# Altium project dory-x.PrjPcb (part 7 of 12)
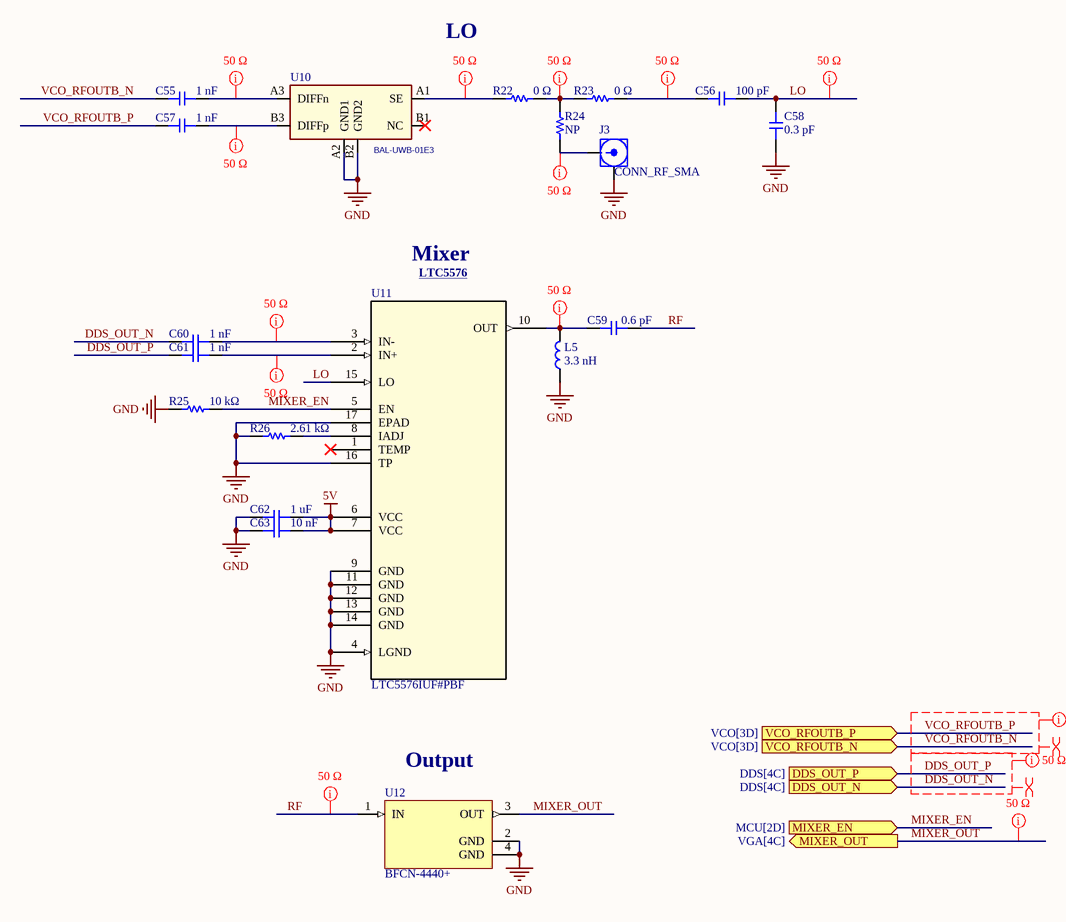
[diagram p13: MIXER.SchDoc]

## Sheet MIXER.SchDoc (continued)

### Library data of the parts (continued)
L5 = IND: Ind RF Chip Unshielded Wirewound 3.3nH 0.1nH 100MHz 30Q-Factor Ferrite 2A 0402 Paper T/R; Manufacturer: Murata Electronics; Manufacturer Part Number: LQW15AN3N3B80D; Manufacturer Lifecycle Status: IN PRODUCTION; Tolerance: +-0.1 nH; Core Material: Non-Magnetic; DC Resistance (DCR): 30mΩ; Number of Circuits: 1; Q Factor: 30; Self Resonant Frequency: 14GHz; Test Frequency: 250MHz; Current Rating: 2 A; Package Size: 0402; Supplier: DigiKey; Supplier Part Number: 490-7641-1-ND; RoHS: Compliant; Category: Fixed Inductors; Stock: 262412; Pricing: 1=0.16, 10=0.134, 100=0.1105, 1000=0.09089, 5000=0.07928 (USD); Case/Package: 0402; Case Code (Imperial): 0402; Case Code (Metric): 1005; Composition: Wirewound; Country of Origin: Japan, Malaysia; Export Control Classification Number (ECCN) Code: EAR99; Height: 500µm; Height - Seated (Max): 609.6µm; Harmonized Tariff Schedule (HTS) Code: 8504.50.80.00; Value: 3.3nH; Introduction Date: 2013-06-20; Length: 1mm; Lifecycle Status: Production; Max Current Rating: 2A; Max DC Current: 2A; Max Operating Temperature: 125°C; Min Operating Temperature: -55°C; Mounting Technology: Surface Mount; Number of Terminals: 2; Packaging: Cut Tape; REACH SVHC: Yes; RMS Current (Irms): 2A; Schedule B: 8504500000, 8504500000|8504500000|8504500000|8504500000|8504500000; ESR: 30mΩ; Shielding: Unshielded; Termination: SMD/SMT; Width: 600µm; ComponentLink1URL: https://datasheet.octopart.com:443/LQW15AN3N3B80D-Murata-datasheet-104420733.pdf?src-supplier=Farnell; ComponentLink1Description: https://datasheet.octopart.com:443/LQW15AN3N3B80D-Murata-datasheet-104420733.pdf?src-supplier=Farnell; ComponentLink2URL: https://datasheet.octopart.com:443/LQW15AN3N3B80D-Murata-datasheet-142541413.pdf?src-supplier=Ciiva; ComponentLink2Description: https://datasheet.octopart.com:443/LQW15AN3N3B80D-Murata-datasheet-142541413.pdf?src-supplier=Ciiva; ComponentLink3URL: https://datasheet.octopart.com:443/LQW15AN3N3B80D-Murata-datasheet-141294499.pdf?src-supplier=Ciiva; ComponentLink3Description: https://datasheet.octopart.com:443/LQW15AN3N3B80D-Murata-datasheet-141294499.pdf?src-supplier=Ciiva; ComponentLink4URL: https://datasheet.octopart.com:443/LQW15AN3N3B80D-Murata-datasheet-140716658.pdf?src-supplier=Ciiva; ComponentLink4Description: https://datasheet.octopart.com:443/LQW15AN3N3B80D-Murata-datasheet-140716658.pdf?src-supplier=Ciiva; ComponentLink5URL: https://datasheet.octopart.com:443/LQW15AN3N3B80D-Murata-datasheet-138757718.pdf?src-supplier=Ciiva; ComponentLink5Description: https://datasheet.octopart.com:443/LQW15AN3N3B80D-Murata-datasheet-138757718.pdf?src-supplier=Ciiva; ComponentLink6URL: https://datasheet.octopart.com:443/LQW15AN3N3B80D-Murata-datasheet-145451984.pdf?src-supplier=Geoflip; ComponentLink6Description: https://datasheet.octopart.com:443/LQW15AN3N3B80D-Murata-datasheet-145451984.pdf?src-supplier=Geoflip; ComponentLink7URL: https://datasheet.octopart.com:443/LQW15AN3N3B80D-Murata-datasheet-142296072.pdf?src-supplier=Arrow.cn; ComponentLink7Description: https://datasheet.octopart.com:443/LQW15AN3N3B80D-Murata-datasheet-142296072.pdf?src-supplier=Arrow.cn; ComponentLink8URL: https://datasheet.octopart.com/LQW15AN3N3B80D-Murata-datasheet-17504633.pdf; ComponentLink8Description: https://datasheet.octopart.com/LQW15AN3N3B80D-Murata-datasheet-17504633.pdf; ComponentLink9URL: http://sigma.octopart.com:80/reach_statement/Murata-company-16.pdf?src-supplier=Compliance+Statements; ComponentLink9Description: http://sigma.octopart.com:80/reach_statement/Murata-company-16.pdf?src-supplier=Compliance+Statements
R22 R23 = RES: GENERAL PURPOSE CHIP RESISTOR Metal Glaze/thick Film, 0.0625W, 0ohm, Surface Mount, 0402; Manufacturer: Yageo; Manufacturer Part Number: RC0402FR-070RL; Power Rating: 1/16 W; Power Dissipation: 62.5mW; Value: 0Ω; Voltage Rating: 50V; Tolerance: *; Package Size: 0402; Supplier: DigiKey; Supplier Part Number: 311-0.0LRCT-ND; RoHS: Compliant; Category: Chip SMD Resistors; Stock: 6847013; Pricing: 1=0.1, 10=0.010, 25=0.0064, 50=0.0054, 100=0.0047, 250=0.00392, 500=0.00346, 1000=0.00304, 5000=0.0023 (USD); Case/Package: 0402; Case Code (Imperial): 0402; Case Code (Metric): 1005; China RoHS: Non-Compliant; Composition: Thick Film; Contact Plating: Tin; Country of Origin: Mainland China, Taiwan; Export Control Classification Number (ECCN) Code: EAR99; Height: 350µm; Harmonized Tariff Schedule (HTS) Code: 8533.21.00.30; Introduction Date: 2004-09-22; Lead Free: Lead Free; Length: 1mm; Lifecycle Status: Production; Max Operating Temperature: 155°C; Min Operating Temperature: -55°C; Mounting Technology: Surface Mount; Number of Terminals: 2; Packaging: Tape & Reel; Radiation Hardening: No; REACH SVHC: Yes; Termination: SMD/SMT; Width: 500µm; ComponentLink1URL: https://datasheet.octopart.com:443/RC0402FR-070RL-Yageo-datasheet-141265859.pdf?src-supplier=Upverter; ComponentLink1Description: https://datasheet.octopart.com:443/RC0402FR-070RL-Yageo-datasheet-141265859.pdf?src-supplier=Upverter; ComponentLink2URL: https://sigma.octopart.com:443/138820526/technical_drawing/Yageo-RC0402FR-070RL.pdf?src-supplier=Upverter; ComponentLink2Description: https://sigma.octopart.com:443/138820526/technical_drawing/Yageo-RC0402FR-070RL.pdf?src-supplier=Upverter; ComponentLink3URL: https://datasheet.octopart.com:443/RC0402FR-070RL-Yageo-datasheet-12531192.pdf?src-supplier=IHS; ComponentLink3Description: https://datasheet.octopart.com:443/RC0402FR-070RL-Yageo-datasheet-12531192.pdf?src-supplier=IHS; ComponentLink4URL: https://datasheet.octopart.com:443/RC0402FR-070RL-Yageo-Group-datasheet-176638170.pdf?src-supplier=Future+Electronics; ComponentLink4Description: https://datasheet.octopart.com:443/RC0402FR-070RL-Yageo-Group-datasheet-176638170.pdf?src-supplier=Future+Electronics; ComponentLink5URL: https://datasheet.octopart.com:443/RC0402FR-070RL-Yageo-datasheet-164759695.pdf?src-supplier=Future+Electronics; ComponentLink5Description: https://datasheet.octopart.com:443/RC0402FR-070RL-Yageo-datasheet-164759695.pdf?src-supplier=Future+Electronics; ComponentLink6URL: https://datasheet.octopart.com:443/RC0402FR-070RL-Yageo-datasheet-137700087.pdf?src-supplier=Future+Electronics; ComponentLink6Description: https://datasheet.octopart.com:443/RC0402FR-070RL-Yageo-datasheet-137700087.pdf?src-supplier=Future+Electronics; ComponentLink7URL: https://datasheet.octopart.com:443/RC0402FR-070RL-Yageo-datasheet-10408619.pdf?src-supplier=Future+Electronics; ComponentLink7Description: https://datasheet.octopart.com:443/RC0402FR-070RL-Yageo-datasheet-10408619.pdf?src-supplier=Future+Electronics; ComponentLink8URL: https://datasheet.octopart.com:443/RC0402FR-070RL-Yageo-datasheet-8324527.pdf?src-supplier=Future+Electronics; ComponentLink8Description: https://datasheet.octopart.com:443/RC0402FR-070RL-Yageo-datasheet-8324527.pdf?src-supplier=Future+Electronics; ComponentLink9URL: https://datasheet.octopart.com:443/RC0402FR-070RL-Yageo-datasheet-79472498.pdf?src-supplier=Megastar; ComponentLink9Description: https://datasheet.octopart.com:443/RC0402FR-070RL-Yageo-datasheet-79472498.pdf?src-supplier=Megastar; ComponentLink10URL: https://datasheet.octopart.com/RC0402FR-070RL-Yageo-datasheet-73766026.pdf; ComponentLink10Description: https://datasheet.octopart.com/RC0402FR-070RL-Yageo-datasheet-73766026.pdf; ComponentLink11URL: http://sigma.octopart.com:80/conflict_mineral_statement/Yageo-company-3.pdf?src-supplier=Compliance+Statements; ComponentLink11Description: http://sigma.octopart.com:80/conflict_mineral_statement/Yageo-company-3.pdf?src-supplier=Compliance+Statements; ComponentLink12URL: http://sigma.octopart.com:80/rohs_statement/Yageo-company-2.pdf?src-supplier=Compliance+Statements; ComponentLink12Description: http://sigma.octopart.com:80/rohs_statement/Yageo-company-2.pdf?src-supplier=Compliance+Statements
R24 = RES: Resistor SMD Generic; Manufacturer: *; Manufacturer Part Number: *; Tolerance: *; Power Rating: *; Package Size: 0402
R25 = RES: Res Thick Film 0402 10K Ohm 1% 0.063W(1/16W) ±100ppm/C Pad SMD T/R; Manufacturer: Yageo; Manufacturer Part Number: RC0402FR-0710KL; Tolerance: +-1%; Power Dissipation: 62.5mW; Value: 10kΩ; Temperature Coefficient: 100ppm/°C; Voltage Rating: 50V; Power Rating: 1/16 W; Package Size: 0402; Supplier: DigiKey; Supplier Part Number: 311-10.0KLRCT-ND; RoHS: Compliant; Category: Chip SMD Resistors; Stock: 8092505; Pricing: 1=0.1, 10=0.007, 25=0.0056, 50=0.004, 100=0.0033, 10000=0.00127 (USD); Case/Package: 0402; Case Code (Imperial): 0402; Case Code (Metric): 0402; China RoHS: Non-Compliant; Composition: Thick Film; Country of Origin: Mainland China, Taiwan; Depth: 500µm; Export Control Classification Number (ECCN) Code: EAR99; Height: 350µm; Harmonized Tariff Schedule (HTS) Code: 8533.21.00.30; Introduction Date: 2004-10-04; Lead Free: Lead Free; Lead Pitch: 200µm; Length: 1mm; Lifecycle Status: Production; Max Operating Temperature: 155°C; Military Standard: Not; Min Operating Temperature: -55°C; Mounting Technology: Surface Mount; Pins: 2; Number of Terminals: 2; Number of Terminations: 2; Packaging: Tape & Reel; REACH SVHC: Yes; Schedule B: 8533210045, 8533210045|8533210045|8533210045|8533210045|8533210045|8533210045|8533210045|8533210045|8533210045|8533210045|8533210045|8533210045|8533210045|8533210045, 8533210045|8533210045|8533210045|8533210045|8533210045|8533210045|8533210045|8533210045|8533210045|8533210045|8533210045|8533210045|8533210045|8533210045|8533210045, 8533210045|8533210045|8533210045|8533210045|8533210045|8533210045|8533210045|8533210045|8533210045|8533210045|8533210045|8533210045|8533210045|8533210045|8533210045|8533210045; Termination: SMD/SMT; Voltage Rating (DC): 50V; Width: 500µm; Working Voltage: 50V; ComponentLink1URL: https://datasheet.octopart.com:443/RC0402FR-0710KL-Yageo-datasheet-175887523.pdf?src-supplier=Newark; ComponentLink1Description: https://datasheet.octopart.com:443/RC0402FR-0710KL-Yageo-datasheet-175887523.pdf?src-supplier=Newark; ComponentLink2URL: https://datasheet.octopart.com:443/RC0402FR-0710KL-Yageo-datasheet-12531192.pdf?src-supplier=Newark; ComponentLink2Description: https://datasheet.octopart.com:443/RC0402FR-0710KL-Yageo-datasheet-12531192.pdf?src-supplier=Newark; ComponentLink3URL: https://datasheet.octopart.com:443/RC0402FR-0710KL-Yageo-datasheet-8324527.pdf?src-supplier=Newark; ComponentLink3Description: https://datasheet.octopart.com:443/RC0402FR-0710KL-Yageo-datasheet-8324527.pdf?src-supplier=Newark; ComponentLink4URL: https://datasheet.octopart.com:443/RC0402FR-0710KL-Yageo-datasheet-10408619.pdf?src-supplier=element14+APAC; ComponentLink4Description: https://datasheet.octopart.com:443/RC0402FR-0710KL-Yageo-datasheet-10408619.pdf?src-supplier=element14+APAC; ComponentLink5URL: https://datasheet.octopart.com:443/RC0402FR-0710KL-Yageo-datasheet-62067350.pdf?src-supplier=element14+APAC; ComponentLink5Description: https://datasheet.octopart.com:443/RC0402FR-0710KL-Yageo-datasheet-62067350.pdf?src-supplier=element14+APAC; ComponentLink6URL: https://datasheet.octopart.com:443/RC0402FR-0710KL-Yageo-datasheet-21426659.pdf?src-supplier=element14+APAC; ComponentLink6Description: https://datasheet.octopart.com:443/RC0402FR-0710KL-Yageo-datasheet-21426659.pdf?src-supplier=element14+APAC; ComponentLink7URL: https://datasheet.octopart.com:443/RC0402FR-0710KL-Yageo-datasheet-164759695.pdf?src-supplier=Upverter; ComponentLink7Description: https://datasheet.octopart.com:443/RC0402FR-0710KL-Yageo-datasheet-164759695.pdf?src-supplier=Upverter; ComponentLink8URL: https://datasheet.octopart.com:443/RC0402FR-0710KL-Yageo-datasheet-103092701.pdf?src-supplier=Upverter; ComponentLink8Description: https://datasheet.octopart.com:443/RC0402FR-0710KL-Yageo-datasheet-103092701.pdf?src-supplier=Upverter; ComponentLink9URL: https://sigma.octopart.com:443/138820526/technical_drawing/Yageo-RC0402FR-0710KL.pdf?src-supplier=Upverter; ComponentLink9Description: https://sigma.octopart.com:443/138820526/technical_drawing/Yageo-RC0402FR-0710KL.pdf?src-supplier=Upverter; ComponentLink10URL: https://datasheet.octopart.com:443/RC0402FR-0710KL-Yageo-datasheet-98239111.pdf?src-supplier=Upverter; ComponentLink10Description: https://datasheet.octopart.com:443/RC0402FR-0710KL-Yageo-datasheet-98239111.pdf?src-supplier=Upverter; ComponentLink11URL: https://datasheet.octopart.com:443/RC0402FR-0710KL-Yageo-datasheet-68298067.pdf?src-supplier=Upverter; ComponentLink11Description: https://datasheet.octopart.com:443/RC0402FR-0710KL-Yageo-datasheet-68298067.pdf?src-supplier=Upverter; ComponentLink12URL: https://datasheet.octopart.com:443/RC0402FR-0710KL-Yageo-datasheet-68297981.pdf?src-supplier=Upverter; ComponentLink12Description: https://datasheet.octopart.com:443/RC0402FR-0710KL-Yageo-datasheet-68297981.pdf?src-supplier=Upverter; ComponentLink13URL: https://datasheet.octopart.com:443/RC0402FR-0710KL-Yageo-datasheet-141435361.pdf?src-supplier=Upverter; ComponentLink13Description: https://datasheet.octopart.com:443/RC0402FR-0710KL-Yageo-datasheet-141435361.pdf?src-supplier=Upverter; ComponentLink14URL: https://datasheet.octopart.com:443/RC0402FR-0710KL-Yageo-datasheet-12509768.pdf?src-supplier=Upverter; ComponentLink14Description: https://datasheet.octopart.com:443/RC0402FR-0710KL-Yageo-datasheet-12509768.pdf?src-supplier=Upverter; ComponentLink15URL: https://datasheet.octopart.com:443/RC0402FR-0710KL-Yageo-Group-datasheet-190305687.pdf?src-supplier=Future+Electronics; ComponentLink15Description: https://datasheet.octopart.com:443/RC0402FR-0710KL-Yageo-Group-datasheet-190305687.pdf?src-supplier=Future+Electronics; ComponentLink16URL: https://datasheet.octopart.com:443/RC0402FR-0710KL-Yageo-datasheet-137700087.pdf?src-supplier=Future+Electronics; ComponentLink16Description: https://datasheet.octopart.com:443/RC0402FR-0710KL-Yageo-datasheet-137700087.pdf?src-supplier=Future+Electronics; ComponentLink17URL: https://datasheet.octopart.com:443/RC0402FR-0710KL-Yageo-datasheet-8324255.pdf?src-supplier=Future+Electronics; ComponentLink17Description: https://datasheet.octopart.com:443/RC0402FR-0710KL-Yageo-datasheet-8324255.pdf?src-supplier=Future+Electronics; ComponentLink18URL: https://datasheet.octopart.com:443/RC0402FR-0710KL-Yageo-datasheet-8329306.pdf?src-supplier=element14; ComponentLink18Description: https://datasheet.octopart.com:443/RC0402FR-0710KL-Yageo-datasheet-8329306.pdf?src-supplier=element14; ComponentLink19URL: https://datasheet.octopart.com:443/RC0402FR-0710KL-Yageo-datasheet-505231.pdf?src-supplier=element14; ComponentLink19Description: https://datasheet.octopart.com:443/RC0402FR-0710KL-Yageo-datasheet-505231.pdf?src-supplier=element14; ComponentLink20URL: https://datasheet.octopart.com:443/RC0402FR-0710KL-Yageo-datasheet-175423674.pdf?src-supplier=SOS+electronic; ComponentLink20Description: https://datasheet.octopart.com:443/RC0402FR-0710KL-Yageo-datasheet-175423674.pdf?src-supplier=SOS+electronic; ComponentLink21URL: https://datasheet.octopart.com:443/RC0402FR-0710KL-Yageo-datasheet-79472498.pdf?src-supplier=Megastar; ComponentLink21Description: https://datasheet.octopart.com:443/RC0402FR-0710KL-Yageo-datasheet-79472498.pdf?src-supplier=Megastar; ComponentLink22URL: https://datasheet.octopart.com/RC0402FR-0710KL-Yageo-datasheet-73766026.pdf; ComponentLink22Description: https://datasheet.octopart.com/RC0402FR-0710KL-Yageo-datasheet-73766026.pdf; ComponentLink23URL: http://sigma.octopart.com:80/conflict_mineral_statement/Yageo-company-3.pdf?src-supplier=Compliance+Statements; ComponentLink23Description: http://sigma.octopart.com:80/conflict_mineral_statement/Yageo-company-3.pdf?src-supplier=Compliance+Statements; ComponentLink24URL: http://sigma.octopart.com:80/rohs_statement/Yageo-company-2.pdf?src-supplier=Compliance+Statements; ComponentLink24Description: http://sigma.octopart.com:80/rohs_statement/Yageo-company-2.pdf?src-supplier=Compliance+Statements
R26 = RES: Fixed Resistor, Thin Film, 0.0625W, 2610ohm, 50V, 1% +/-Tol, 50ppm/Cel, Surface Mount, 0402; Manufacturer: Yageo; Manufacturer Part Number: RT0402FRE072K61L; Tolerance: +-1%; Power Rating: 1/16 W; Max Power Dissipation: 63mW; Power Dissipation: 62.5mW; Value: 2.61kΩ; Temperature Coefficient: 50ppm/°C; Package Size: 0402; Supplier: DigiKey; Supplier Part Number: 13-RT0402FRE072K61LCT-ND; RoHS: Compliant; Category: Chip SMD Resistors; Stock: 4450; Pricing: 1=0.1, 10=0.015, 25=0.0148, 50=0.0142, 100=0.0138, 250=0.01328, 500=0.01122, 1000=0.0083 (USD); Case/Package: 0402; Case Code (Metric): 0402; China RoHS: Non-Compliant; Composition: Thin Film; Contact Plating: Tin; Depth: 500µm; Height: 300µm; Lead Free: Lead Free; Length: 1mm; Lifecycle Status: Production; Max Operating Temperature: 155°C; Military Standard: Not; Min Operating Temperature: -55°C; Mounting Technology: Surface Mount; Number of Terminals: 2; Number of Terminations: 2; Packaging: Tape & Reel (TR); Radiation Hardening: No; REACH SVHC: Yes; Voltage Rating: 50V; Voltage Rating (DC): 50V; Width: 500µm; Working Voltage: 50V; ComponentLink1URL: https://datasheet.octopart.com:443/RT0402FRE072K61L-Yageo-datasheet-176402239.pdf?src-supplier=Future+Electronics; ComponentLink1Description: https://datasheet.octopart.com:443/RT0402FRE072K61L-Yageo-datasheet-176402239.pdf?src-supplier=Future+Electronics; ComponentLink2URL: https://datasheet.octopart.com:443/RT0402FRE072K61L-Yageo-datasheet-169971040.pdf?src-supplier=Future+Electronics; ComponentLink2Description: https://datasheet.octopart.com:443/RT0402FRE072K61L-Yageo-datasheet-169971040.pdf?src-supplier=Future+Electronics; ComponentLink3URL: https://datasheet.octopart.com:443/RT0402FRE072K61L-Yageo-datasheet-166250672.pdf?src-supplier=Future+Electronics; ComponentLink3Description: https://datasheet.octopart.com:443/RT0402FRE072K61L-Yageo-datasheet-166250672.pdf?src-supplier=Future+Electronics; ComponentLink4URL: https://datasheet.octopart.com:443/RT0402FRE072K61L-Yageo-datasheet-141265893.pdf?src-supplier=Future+Electronics; ComponentLink4Description: https://datasheet.octopart.com:443/RT0402FRE072K61L-Yageo-datasheet-141265893.pdf?src-supplier=Future+Electronics; ComponentLink5URL: https://datasheet.octopart.com:443/RT0402FRE072K61L-Yageo-datasheet-96443642.pdf?src-supplier=Upverter; ComponentLink5Description: https://datasheet.octopart.com:443/RT0402FRE072K61L-Yageo-datasheet-96443642.pdf?src-supplier=Upverter; ComponentLink6URL: https://datasheet.octopart.com/RT0402FRE072K61L-Yageo-datasheet-86813807.pdf; ComponentLink6Description: https://datasheet.octopart.com/RT0402FRE072K61L-Yageo-datasheet-86813807.pdf; ComponentLink7URL: http://sigma.octopart.com:80/conflict_mineral_statement/Yageo-company-3.pdf?src-supplier=Compliance+Statements; ComponentLink7Description: http://sigma.octopart.com:80/conflict_mineral_statement/Yageo-company-3.pdf?src-supplier=Compliance+Statements; ComponentLink8URL: http://sigma.octopart.com:80/rohs_statement/Yageo-company-2.pdf?src-supplier=Compliance+Statements; ComponentLink8Description: http://sigma.octopart.com:80/rohs_statement/Yageo-company-2.pdf?src-supplier=Compliance+Statements
U10 = BAL-UWB-01E3: Balun, 1dB, 8GHz, FLIP CHIP BUMPLESS CSPG, RoHS, Tape And Reel; Manufacturer: STMicroelectronics; Insertion Loss (dB): 1.2dB; Supplier: DigiKey; Supplier Part Number: 497-19458-1-ND; Manufacturer Part Number: BAL-UWB-01E3; RoHS: Compliant; Category: Balun Transformers; Stock: 18249; Pricing: 1=0.48, 10=0.434, 25=0.4176, 50=0.4054, 100=0.3934, 250=0.37808, 500=0.36678, 1000=0.35573 (USD); China RoHS: Compliant; Lifecycle Status: Production; Clock Frequency: 8GHz; Max Operating Temperature: 105°C; Min Operating Temperature: -40°C; Mounting Technology: Surface Mount; Packaging: Tape and Reel; REACH SVHC: Yes; ComponentLink1URL: https://datasheet.octopart.com:443/BAL-UWB-01E3-STMicroelectronics-datasheet-140368716.pdf?src-supplier=Newark; ComponentLink1Description: https://datasheet.octopart.com:443/BAL-UWB-01E3-STMicroelectronics-datasheet-140368716.pdf?src-supplier=Newark
U11 = LTC5576IUFPBF: IC Mixer Down Converter 16QFN "rf Mixer IC Cellular, Wlan 3GHZ ~ 8GHZ 16-QFN (4X4)"; Manufacturer_Name: Analog Devices Inc; Manufacturer: Analog Devices; Manufacturer Lifecycle Status: PRODUCTION; Bandwidth: 5GHz; Gain: -2dB; Max Junction Temperature (Tj): 150°C; Max Supply Voltage: 5.3V; Min Supply Voltage: 3.1V; Noise Figure: 17.5dB; Operating Supply Current: 99mA; Copyright: Copyright (C) 2026 Ultra Librarian. All rights reserved.; Manufacturer_Part_Number: LTC5576IUF#PBF; Datasheet: https://www.analog.com/media/en/technical-documentation/data-sheets/5576fa.pdf; RefDes: RefDes; Type: Type; Supplier: DigiKey; Supplier Part Number: LTC5576IUF#PBF-ND; Manufacturer Part Number: LTC5576IUF#PBF; RoHS: Compliant; Category: RF Mixers; Stock: 96; Pricing: 1=23.48, 10=18.838, 91=16.47374, 182=15.98703, 273=15.74326, 546=15.38584 (USD); Case/Package: QFN; Height: 800µm; Lifecycle Status: Production; Clock Frequency: 8GHz; Max Operating Temperature: 105°C; Min Operating Temperature: -40°C; Pins: 16; Schedule B: 8542390000, 8542390000|8542390000, 8542390000|8542390000|8542390000, 8542390000|8542390000|8542390000|8542390000; ComponentLink1URL: https://octopart.com:443/opatz8j6/c1?t=XoIMKlOqzTdx8TwXZ3V6vw6B6fVuNLb-fIFDFTh2iDMAj3WzwWLjnAgqbpD0nGfKJ7Bo2EGu2_yL2esKNM1ekf--CIgm_OyKkYNbzrKZvAYcVneP7PSl531j5EW0y4gBit6wuWrvEVGjl41SpPjnYwpL-1Zz79GuI5hTkcgBr9jvG4zQqjmX-YqsClTMIOhsJy0W5uObjM8eSKI8EGqeBZ4NnLYYRNdwqXo-mnjs7ovUiTIyq2pZP5EGqc9Z2AeHqZcnAQfA-ALSou4jknySlLeAWcYSnCxPjfe6fkt_PmiJfxAwmpNWVkM&src-supplier=Analog+Devices; ComponentLink1Description: https://octopart.com:443/opatz8j6/c1?t=XoIMKlOqzTdx8TwXZ3V6vw6B6fVuNLb-fIFDFTh2iDMAj3WzwWLjnAgqbpD0nGfKJ7Bo2EGu2_yL2esKNM1ekf--CIgm_OyKkYNbzrKZvAYcVneP7PSl531j5EW0y4gBit6wuWrvEVGjl41SpPjnYwpL-1Zz79GuI5hTkcgBr9jvG4zQqjmX-YqsClTMIOhsJy0W5uObjM8eSKI8EGqeBZ4NnLYYRNdwqXo-mnjs7ovUiTIyq2pZP5EGqc9Z2AeHqZcnAQfA-ALSou4jknySlLeAWcYSnCxPjfe6fkt_PmiJfxAwmpNWVkM&src-supplier=Analog+Devices; ComponentLink2URL: https://datasheet.octopart.com:443/LTC5576IUF%23PBF-Analog-Devices-datasheet-62314079.pdf?src-supplier=Newark; ComponentLink2Description: https://datasheet.octopart.com:443/LTC5576IUF%23PBF-Analog-Devices-datasheet-62314079.pdf?src-supplier=Newark; ComponentLink3URL: https://datasheet.octopart.com:443/LTC5576IUF%23PBF-Linear-Technology-datasheet-43875454.pdf?src-supplier=Linear+Technology; ComponentLink3Description: https://datasheet.octopart.com:443/LTC5576IUF%23PBF-Linear-Technology-datasheet-43875454.pdf?src-supplier=Linear+Technology; ComponentLink4URL: https://sigma.octopart.com:443/57697086/technical_drawing/Linear-Technology-LTC5576IUF%23PBF.pdf?src-supplier=Linear+Technology; ComponentLink4Description: https://sigma.octopart.com:443/57697086/technical_drawing/Linear-Technology-LTC5576IUF%23PBF.pdf?src-supplier=Linear+Technology; ComponentLink5URL: http://sigma.octopart.com:80/conflict_mineral_statement/Analog-Devices-company-33.pdf?src-supplier=Compliance+Statements; ComponentLink5Description: http://sigma.octopart.com:80/conflict_mineral_statement/Analog-Devices-company-33.pdf?src-supplier=Compliance+Statements; ComponentLink6URL: https://octopart.com:443/opatz8j6/c1?t=iaBT8UDAQnXNiWNswkpBwMVbTOZEZmHCaOcWEXFpb7NEXnGTLzZdU52f4Sw5tFM3qlFC8evPzD01_lEYSIl-5j4TqVoy1QmTL-GFt2RWvwff7sPvXIWI_EyHxXw9-vLto4gBSD33N_iqN9_GzeO2cgWc1_gJrcgJc4zytDLzdrfRkyQsxuDOs_Ke7l4Ueqa3wji9nHnlGX1TcHA2bzR2ynsjMEE3d8aY30gjLWMhJNPJeVYmO8yqdqodLDzLvna1DePTaJwlGps9DkOY7NbJxc5lPJNdlAb_oPGJtTH9XpftmrPXEa4Sxxc&src-supplier=Compliance+Statements; ComponentLink6Description: https://octopart.com:443/opatz8j6/c1?t=iaBT8UDAQnXNiWNswkpBwMVbTOZEZmHCaOcWEXFpb7NEXnGTLzZdU52f4Sw5tFM3qlFC8evPzD01_lEYSIl-5j4TqVoy1QmTL-GFt2RWvwff7sPvXIWI_EyHxXw9-vLto4gBSD33N_iqN9_GzeO2cgWc1_gJrcgJc4zytDLzdrfRkyQsxuDOs_Ke7l4Ueqa3wji9nHnlGX1TcHA2bzR2ynsjMEE3d8aY30gjLWMhJNPJeVYmO8yqdqodLDzLvna1DePTaJwlGps9DkOY7NbJxc5lPJNdlAb_oPGJtTH9XpftmrPXEa4Sxxc&src-supplier=Compliance+Statements
U12 = BFCN-4440+: Ceramic BPF, 1 Section(s) Min, 1 Section(s) Max, 4440MHz; Manufacturer: Mini-Circuits; Cutoff Frequency: 4.44GHz; Insertion Loss (dB): 2dB; Manufacturer Part Number: BFCN-4440+; Supplier: DigiKey; Supplier Part Number: 3157-BFCN-4440+CT-ND; RoHS: Compliant; Category: Ceramic Filters; Stock: 3974; Pricing: 1=14.95, 20=6.6, 50=6.3, 100=5.988, 200=5.29205, 500=5.13602, 1000=5.1255 (USD); Export Control Classification Number (ECCN) Code: EAR99; Height: 940µm; Introduction Date: 2008-02-14; Length: 3.2mm; Lifecycle Status: Production; Max Operating Temperature: 100°C; Min Operating Temperature: -55°C; REACH SVHC: Yes; Width: 1.6mm; ComponentLink1URL: https://datasheet.octopart.com:443/BFCN-4440%2B-Mini-Circuits-datasheet-62330094.pdf?src-supplier=Component+Distributors+Inc.; ComponentLink1Description: https://datasheet.octopart.com:443/BFCN-4440%2B-Mini-Circuits-datasheet-62330094.pdf?src-supplier=Component+Distributors+Inc.

## Sheet VGA.SchDoc
size Letter; DrawnBy: Titan Yuan; SheetNumber: 4; SheetTotal: 8
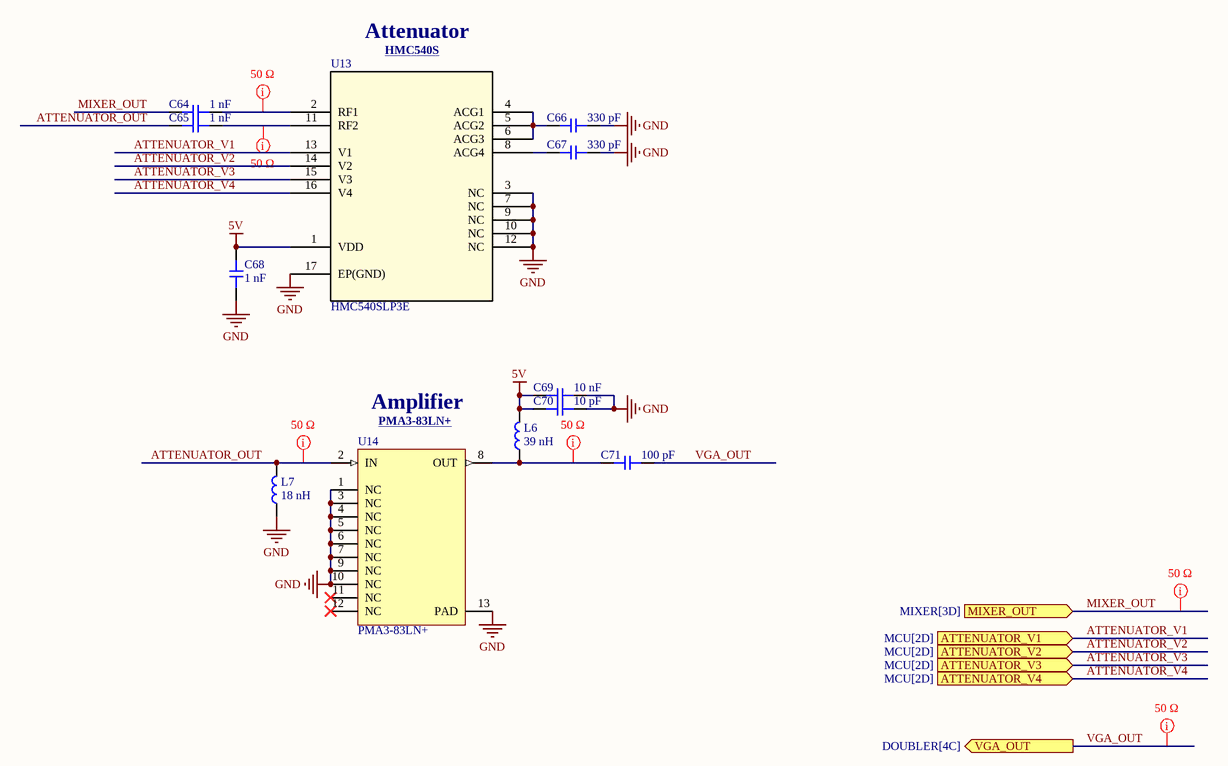
[diagram p3: VGA.SchDoc]

### Parts
C64  1 nF  [CAP_0402]
C65  1 nF  [CAP_0402]
C66  330 pF  [CAP_0402]
C67  330 pF  [CAP_0402]
C68  1 nF  [CAP_0402]
C69  10 nF  [CAP_0402]
C70  10 pF  [CAP_0402]
C71  100 pF  [CAP_0402]
L6  39 nH  [IND_0402]
L7  18 nH  [IND_0402]
U13  HMC540SLP3E  [HCP_16_1_ADI]
U14  PMA3-83LN+  [PL-456]

### Ports
ATTENUATOR_V1 (in, see MCU[2D]), ATTENUATOR_V2 (in, see MCU[2D]), ATTENUATOR_V3 (in, see MCU[2D]), ATTENUATOR_V4 (in, see MCU[2D]), MIXER_OUT (in, see MIXER[3D]), VGA_OUT (out, see DOUBLER[4C])

### Nets
5V: C68.2 C69.1 C70.1 L6.2 U13.1(VDD)
GND: C66.2 C67.2 C68.1 C69.2 C70.2 L7.1 U13.3(NC) U13.7(NC) U13.9(NC) U13.10(NC) U13.12(NC) U13.17(EP(GND)) U14.1(NC) U14.3(NC) U14.4(NC) U14.5(NC) U14.6(NC) U14.7(NC) U14.9(NC) U14.10(NC) U14.13(PAD)
ATTENUATOR_OUT: C65.2 L7.2 U14.2(IN)  [project net ATTENUATOR_OUT_4]
ATTENUATOR_V1: U13.13(V1) ; port ATTENUATOR_V1
ATTENUATOR_V2: U13.14(V2) ; port ATTENUATOR_V2
ATTENUATOR_V3: U13.15(V3) ; port ATTENUATOR_V3
ATTENUATOR_V4: U13.16(V4) ; port ATTENUATOR_V4
MIXER_OUT: C64.2 ; port MIXER_OUT
VGA_OUT: C71.1 ; port VGA_OUT
NetC64_1: C64.1 U13.2(RF1)
NetC65_1: C65.1 U13.11(RF2)
NetC66_1: C66.1 U13.4(ACG1) U13.5(ACG2) U13.6(ACG3)
NetC67_1: C67.1 U13.8(ACG4)
NetC71_2: C71.2 L6.1 U14.8(OUT)

Not connected (* = marked no-connect by the designer): U14 11(NC)* 12(NC)*

### Layout directives
net class 50 Ω: ATTENUATOR_OUT_4, MIXER_OUT, NetC64_1, NetC65_1, NetC71_2, VGA_OUT

### Notes on the sheet
- Attenuator
- HMC540S <https://www.analog.com/en/products/hmc540s.html>
- Amplifier
- (near U14) PMA3-83LN+ <https://www.minicircuits.com/WebStore/dashboard.html?model=PMA3-83LN%2B>